# Altium project 4T2_Project_File.PrjPcb
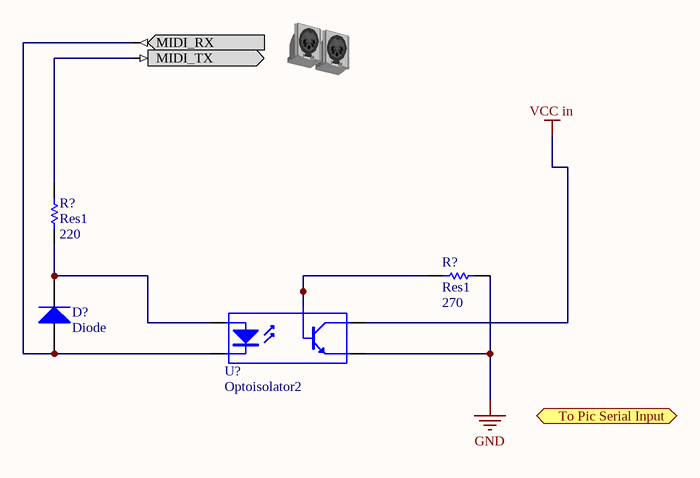
[diagram p0: Midi conector .SchDoc]
7 sheets, 57 parts. Net scope: flat (ports and power ports of the same name join across sheets).
Sheets:
  Midi conector .SchDoc
  Lcd connector.SchDoc
  pic33.SchDoc
  audioleft.SchDoc
  audiorigth.SchDoc
  Jack.SchDoc
  led encoder 1.SchDoc

## Sheet Midi conector .SchDoc
size A

### Parts
(Parts that share a designator on the sheet are numbered #1, #2 ... from top to bottom, then left to right.)
?  MIDI  (value not drawn)
D?#1  Diode  [SMC]
R?#1  Res1  value 220  [AXIAL-0.3]
R?#2  Res1  value 270  [AXIAL-0.3]
U?#1  Optoisolator2  [SOP5(6)]

### Ports
To Pic Serial Input (out)

### Nets
GND: R?#2.1 U?#1.4(E)
VCC in: U?#1.5(C)
Net?_MIDI_RX: ?.MIDI_RX D?#1.1(A) U?#1.3(K)
Net?_MIDI_TX: ?.MIDI_TX R?#1.2
NetD?#1_2: D?#1.2(K) R?#1.1 U?#1.1(A)
NetR?#2_2: R?#2.2 U?#1.6(B)

### Library data of the parts
? = MIDI: MIDI Connector; RefFabricant: PSG03463; RefConstructeur: 1791756; Constructeur: PRO SIGNAL
D?#1 = Diode: 1n914; Constructeur: FAIRCHILD SEMICONDUCTOR; RefConstructeur: 1N4454
R?#1 R?#2 = Res1: Resistor; Published: 8-Jun-2000; LatestRevisionDate: 17-Jul-2002; LatestRevisionNote: Re-released for DXP Platform.; PackageReference: AXIAL-0.3; Publisher: Altium Limited; PackageDescription: Axial Device, Thru-Hole; 2 Leads; 0.3 in Pin Spacing
U?#1 = Optoisolator2: 5 Pin Mini Flat Pack Optocoupler; RefFabricant: 6N138; RefFournisseur: 1225822; Fournisseur: TOSHIBA

## Sheet Lcd connector.SchDoc
size A
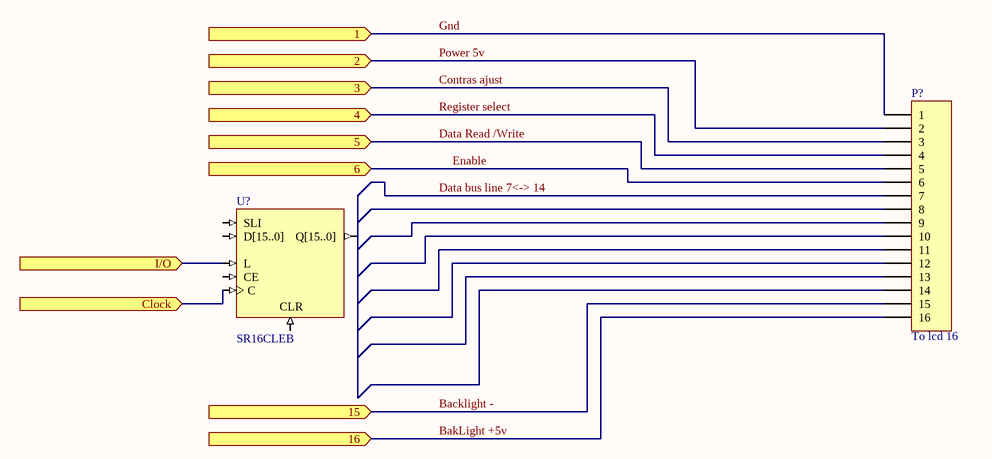
[diagram p1: Lcd connector.SchDoc]

### Parts
(Parts that share a designator on the sheet are numbered #1, #2 ... from top to bottom, then left to right.)
P?  To lcd 16  [HDR1X16]
U?#2  SR16CLEB

### Ports
1 (in), 2 (in), 3 (in), 4 (in), 5 (in), 6 (in), 15 (in), 16 (in), Clock (in), I/O (in)

### Nets
Backlight -: P?.15 ; port 15
BakLight +5v: P?.16 ; port 16
Contras ajust: P?.3 ; port 3
Data bus line 7<-> 14: P?.7
Data Read /Write: P?.5 ; port 5
Enable: P?.6 ; port 6
Gnd: P?.1 ; port 1
Power 5v: P?.2 ; port 2
Register select: P?.4 ; port 4
NetU?#2_C: U?#2.C ; port Clock
NetU?#2_L: U?#2.L ; port I/O

Not connected (* = marked no-connect by the designer): P? 8 9 10 11 12 13 14; U?#2 CE CLR D[15..0] Q[15..0] SLI

### Library data of the parts
P? = Header 16: Header, 16-Pin; LatestRevisionDate: 17-Jul-2002; LatestRevisionNote: Re-released for DXP Platform.; Publisher: Altium Limited
U?#2 = SR16CLEB: 16-Bit Loadable Serial/Parallel-In Parallel-Out Shift Registers with Clock Enable and Asynchronous Clear, Bus Version; ClockTrigger: Rising; Enable: High; Loadable: True; PortSize: 16; ArchiveName: GENERIC; VHDLIB_SIM: GENERIC_LIB; Published: 29-Jan-2004; Publisher: Altium Limited; XilinxEquivalent: SR16CLE; LastRevisionNo: 1.00.00; HelpURL: CR0118 FPGA Generic Library Guide.pdf#page=432; ComponentLink1URL: CR0141 FPGA Shift Register Resource Usage.pdf#page=28; ComponentLink1Description: Core &Resource Usage; FunctionalClass: Shift Register; Reset: Asynchronous; PortStyle: Bus Version

## Sheet pic33.SchDoc
size A
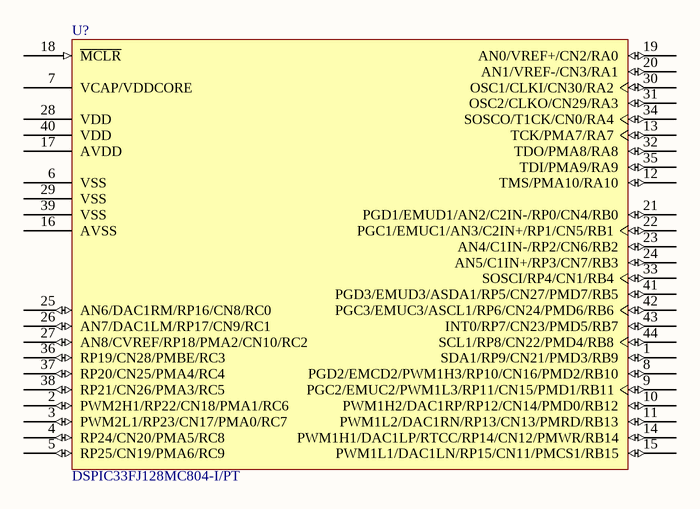
[diagram p2: pic33.SchDoc]

### Parts
(Parts that share a designator on the sheet are numbered #1, #2 ... from top to bottom, then left to right.)
U?#3  DSPIC33FJ128MC804-I/PT  [TQFP-PT44_N]

### Nets

Not connected (* = marked no-connect by the designer): U?#3 1(SDA1/RP9/CN21/PMD3/RB9) 2(PWM2H1/RP22/CN18/PMA1/RC6) 3(PWM2L1/RP23/CN17/PMA0/RC7) 4(RP24/CN20/PMA5/RC8) 5(RP25/CN19/PMA6/RC9) 6(VSS) 7(VCAP/VDDCORE) 8(PGD2/EMCD2/PWM1H3/RP10/CN16/PMD2/RB10) 9(PGC2/EMUC2/PWM1L3/RP11/CN15/PMD1/RB11) 10(PWM1H2/DAC1RP/RP12/CN14/PMD0/RB12) 11(PWM1L2/DAC1RN/RP13/CN13/PMRD/RB13) 12(TMS/PMA10/RA10) 13(TCK/PMA7/RA7) 14(PWM1H1/DAC1LP/RTCC/RP14/CN12/PMWR/RB14) 15(PWM1L1/DAC1LN/RP15/CN11/PMCS1/RB15) 16(AVSS) 17(AVDD) 18(~{MCLR}) 19(AN0/VREF+/CN2/RA0) 20(AN1/VREF-/CN3/RA1) 21(PGD1/EMUD1/AN2/C2IN-/RP0/CN4/RB0) 22(PGC1/EMUC1/AN3/C2IN+/RP1/CN5/RB1) 23(AN4/C1IN-/RP2/CN6/RB2) 24(AN5/C1IN+/RP3/CN7/RB3) 25(AN6/DAC1RM/RP16/CN8/RC0) 26(AN7/DAC1LM/RP17/CN9/RC1) 27(AN8/CVREF/RP18/PMA2/CN10/RC2) 28(VDD) 29(VSS) 30(OSC1/CLKI/CN30/RA2) 31(OSC2/CLKO/CN29/RA3) 32(TDO/PMA8/RA8) 33(SOSCI/RP4/CN1/RB4) 34(SOSCO/T1CK/CN0/RA4) 35(TDI/PMA9/RA9) 36(RP19/CN28/PMBE/RC3) 37(RP20/CN25/PMA4/RC4) 38(RP21/CN26/PMA3/RC5) 39(VSS) 40(VDD) 41(PGD3/EMUD3/ASDA1/RP5/CN27/PMD7/RB5) 42(PGC3/EMUC3/ASCL1/RP6/CN24/PMD6/RB6) 43(INT0/RP7/CN23/PMD5/RB7) 44(SCL1/RP8/CN22/PMD4/RB8)

### Library data of the parts
U?#3 = DSPIC33FJ128MC804-I/PT: High-Performance 16-bit Digital Signal Controller, 128 KB Flash, 16 KB RAM, 44-Pin TQFP, Industrial Temperature; Published: 29-Jan-2009; LatestRevisionDate: 02-Dec-2009; LatestRevisionNote: Updated to datasheet revision D, Nov-2009; DatasheetVersion: revD, Nov-2009; PackageVersion: revBB, Aug-2009; PackageReference: TQFP-PT44; Publisher: Altium Limited; PackageDescription: 44-Lead Plastic Thin Quad Flatpack (PT) - 10x10x1mm Body, 2.00mm [TQFP]; Supplier 1: Digi-Key; Supplier Part Number 1: DSPIC33FJ128MC804-I/PT-ND; Supplier 2: Farnell; Supplier Part Number 2: 1576810; Code_JEDEC: MS-026; ComponentLink1Description: Datasheet; ComponentLink1URL: http://ww1.microchip.com/downloads/en/DeviceDoc/70291D.pdf; ComponentLink2Description: Packaging Specification; ComponentLink2URL: http://www.microchip.com/stellent/groups/techpub_sg/documents/packagingspec/en012702.pdf; ComponentLink3Description: Microchip.com Home; ComponentLink3URL: http://www.microchip.com/

## Sheet audioleft.SchDoc
size A
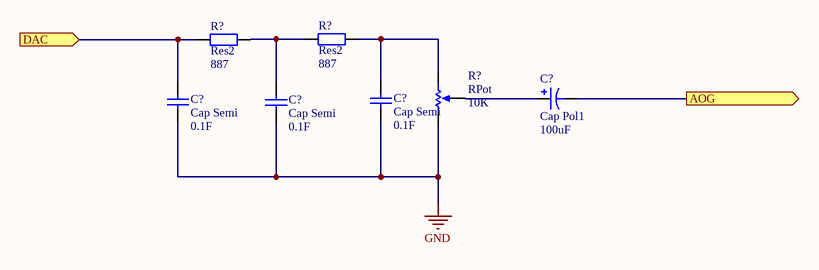
[diagram p3: audioleft.SchDoc]

### Parts
(Parts that share a designator on the sheet are numbered #1, #2 ... from top to bottom, then left to right.)
C?#1  Cap Pol1  value 100uF  [RB7.6-15]
C?#2  Cap Semi  value 0.1F  [C2512]
C?#3  Cap Semi  value 0.1F  [C2512]
C?#4  Cap Semi  value 0.1F  [C2512]
R?#3  Res2  value 887  [AXIAL-0.4]
R?#4  Res2  value 887  [AXIAL-0.4]
R?#5  RPot  value 10K  [VR5]

### Ports
AOG (out), DAC (in)

### Nets
GND: C?#2.1 C?#3.1 C?#4.1 R?#5.1(TOP)
NetC?#1_1: C?#1.1 R?#5.3(TAP)
NetC?#1_2: C?#1.2 ; port AOG
NetC?#2_2: C?#2.2 R?#3.1 ; port DAC
NetC?#3_2: C?#3.2 R?#3.2 R?#4.1
NetC?#4_2: C?#4.2 R?#4.2 R?#5.2(BOT)

### Library data of the parts
C?#1 = Cap Pol1: Polarized Capacitor (Radial); Constructeur: PANASONIC; Ref constructeur: EEUFM1E101; Vendeur: Farnell
C?#2-C?#4 = Cap Semi: Capacitor (Semiconductor SIM Model); Vendeur: Farnell; Fabricant: KEMET; Ref Fabricant: FG0H104ZF
R?#3 R?#4 = Res2: Resistor; Fabricant: VISHAY BC COMPONENTS; Ref Fabricant: MRS25000C8870FCT00; Vendeur: Farnell
R?#5 = RPot: Potentiometer; Fabricant: TE CONNECTIVITY / CITEC; Ref Fabricant: CP16SH10IP06103F; Vendeur: Farnell

## Sheet audiorigth.SchDoc
size A
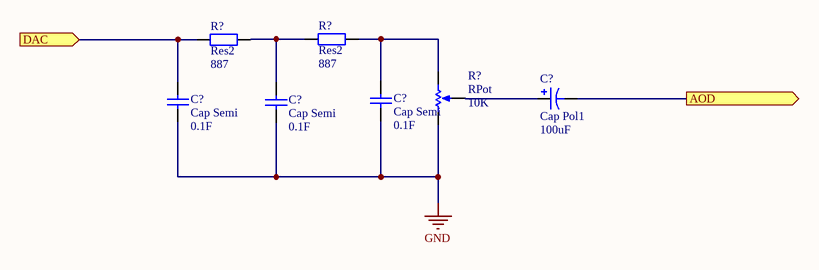
[diagram p4: audiorigth.SchDoc]

### Parts
(Parts that share a designator on the sheet are numbered #1, #2 ... from top to bottom, then left to right.)
C?#5  Cap Pol1  value 100uF  [RB7.6-15]
C?#6  Cap Semi  value 0.1F  [C2512]
C?#7  Cap Semi  value 0.1F  [C2512]
C?#8  Cap Semi  value 0.1F  [C2512]
R?#6  Res2  value 887  [AXIAL-0.4]
R?#7  Res2  value 887  [AXIAL-0.4]
R?#8  RPot  value 10K  [VR5]

### Ports
AOD (out), DAC (in)

### Nets
GND: C?#6.1 C?#7.1 C?#8.1 R?#8.1(TOP)
NetC?#2_2: C?#6.2 R?#6.1 ; port DAC
NetC?#5_1: C?#5.1 R?#8.3(TAP)
NetC?#5_2: C?#5.2 ; port AOD
NetC?#7_2: C?#7.2 R?#6.2 R?#7.1
NetC?#8_2: C?#8.2 R?#7.2 R?#8.2(BOT)

### Library data of the parts
C?#5 = Cap Pol1: as C?#1 on sheet audioleft
C?#6-C?#8 = Cap Semi: as C?#2 on sheet audioleft
R?#6 R?#7 = Res2: as R?#3 on sheet audioleft
R?#8 = RPot: as R?#5 on sheet audioleft

## Sheet Jack.SchDoc
size A
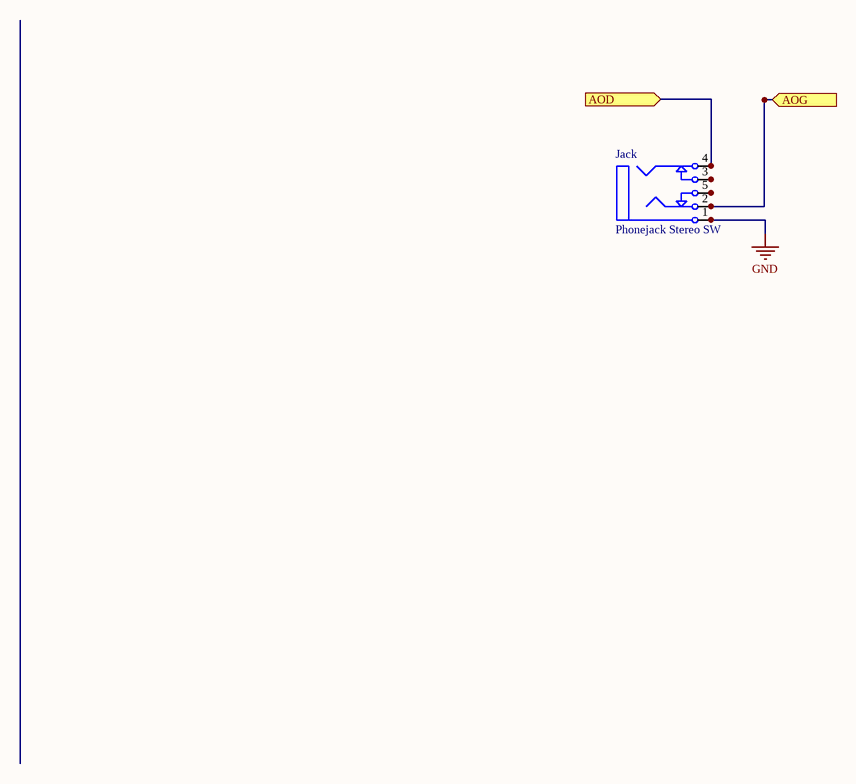
[diagram p5: Jack.SchDoc]

### Parts
Jack  Phonejack Stereo SW  [ST-3150-5N]

### Ports
AOD (in), AOG (in)

### Nets
GND: Jack.1 Jack.1A Jack.1B
NetC?#1_2: Jack.2 Jack.2A Jack.2B ; port AOG
NetC?#5_2: Jack.4 Jack.4A Jack.4B ; port AOD
NetJack_3: Jack.3 Jack.3A Jack.3B
NetJack_5: Jack.5 Jack.5A Jack.5B

### Library data of the parts
Jack = Phonejack Stereo SW: 3-Conductor Jack with 2 break contacts (normals) and 2 auxiliary make contacts; Ref constructeur: ACJM-PVB-2S; Constructeur: Amphenol; Vendeur: Farnell

## Sheet led encoder 1.SchDoc
size A
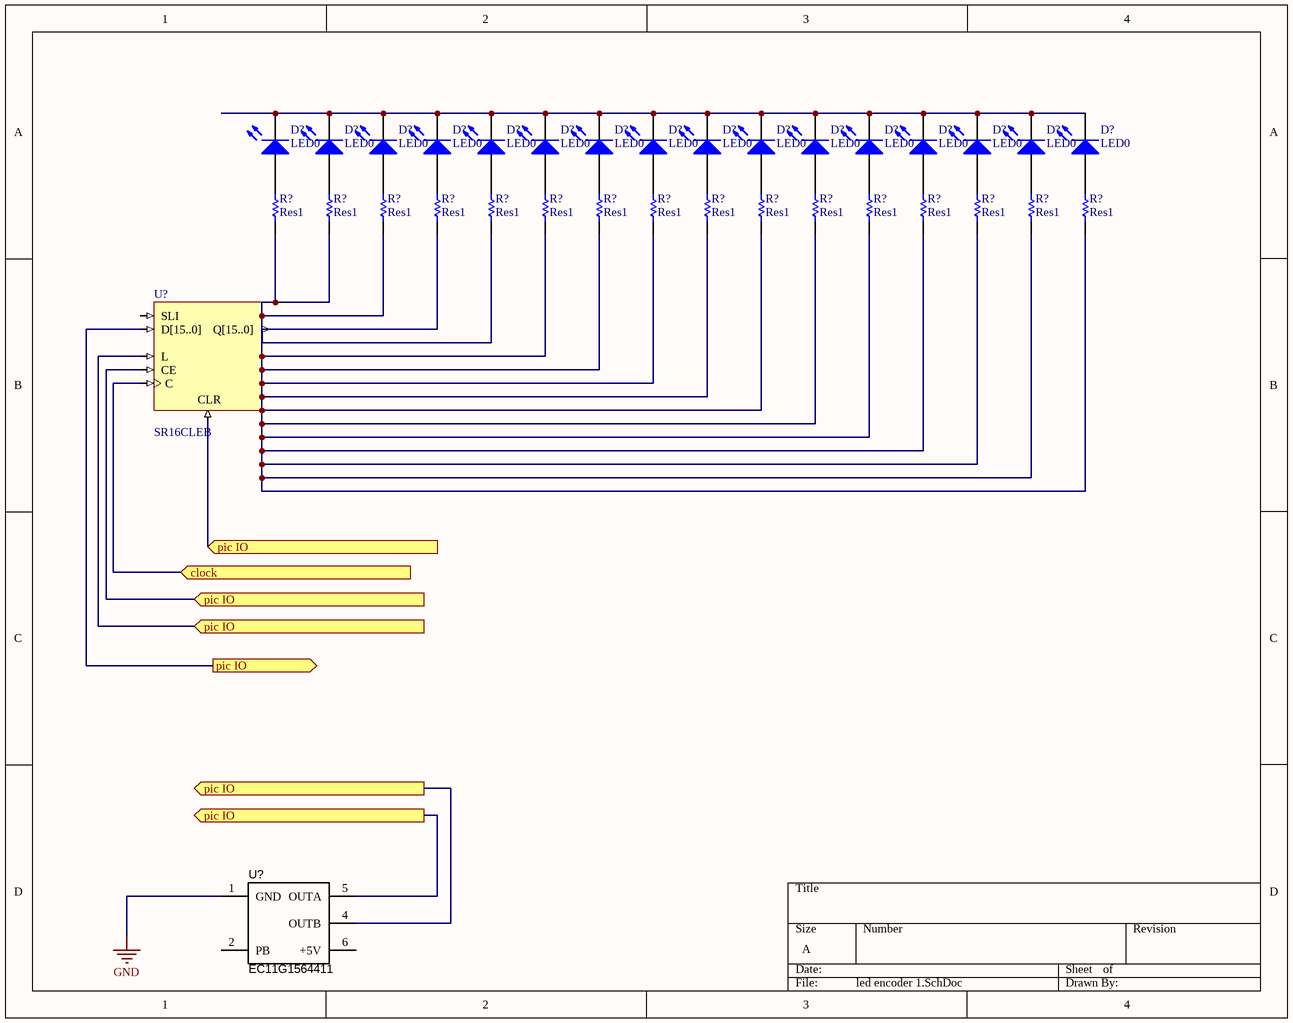
[diagram p6: led encoder 1.SchDoc]

### Parts
(Parts that share a designator on the sheet are numbered #1, #2 ... from top to bottom, then left to right.)
D?#2  LED0  [LED-0]
D?#3  LED0  [LED-0]
D?#4  LED0  [LED-0]
D?#5  LED0  [LED-0]
D?#6  LED0  [LED-0]
D?#7  LED0  [LED-0]
D?#8  LED0  [LED-0]
D?#9  LED0  [LED-0]
D?#10  LED0  [LED-0]
D?#11  LED0  [LED-0]
D?#12  LED0  [LED-0]
D?#13  LED0  [LED-0]
D?#14  LED0  [LED-0]
D?#15  LED0  [LED-0]
D?#16  LED0  [LED-0]
D?#17  LED0  [LED-0]
R?#9  Res1  [AXIAL-0.3]
R?#10  Res1  [AXIAL-0.3]
R?#11  Res1  [AXIAL-0.3]
R?#12  Res1  [AXIAL-0.3]
R?#13  Res1  [AXIAL-0.3]
R?#14  Res1  [AXIAL-0.3]
R?#15  Res1  [AXIAL-0.3]
R?#16  Res1  [AXIAL-0.3]
R?#17  Res1  [AXIAL-0.3]
R?#18  Res1  [AXIAL-0.3]
R?#19  Res1  [AXIAL-0.3]
R?#20  Res1  [AXIAL-0.3]
R?#21  Res1  [AXIAL-0.3]
R?#22  Res1  [AXIAL-0.3]
R?#23  Res1  [AXIAL-0.3]
R?#24  Res1  [AXIAL-0.3]
U?#4  SR16CLEB
U?#5  EC11G1564411  [EC11G1564411]  (mechanical)

### Ports
clock (in), pic IO (in), pic IO (out)

### Nets
GND: U?#5.1(GND)
NetD?#2_1: D?#2.1(A) R?#9.2
NetD?#2_2: D?#2.2(K) D?#3.2(K) D?#4.2(K) D?#5.2(K) D?#6.2(K) D?#7.2(K) D?#8.2(K) D?#9.2(K) D?#10.2(K) D?#11.2(K) D?#12.2(K) D?#13.2(K) D?#14.2(K) D?#15.2(K) D?#16.2(K) D?#17.2(K)
NetD?#3_1: D?#3.1(A) R?#10.2
NetD?#4_1: D?#4.1(A) R?#11.2
NetD?#5_1: D?#5.1(A) R?#12.2
NetD?#6_1: D?#6.1(A) R?#13.2
NetD?#7_1: D?#7.1(A) R?#14.2
NetD?#8_1: D?#8.1(A) R?#15.2
NetD?#9_1: D?#9.1(A) R?#16.2
NetD?#10_1: D?#10.1(A) R?#17.2
NetD?#11_1: D?#11.1(A) R?#18.2
NetD?#12_1: D?#12.1(A) R?#19.2
NetD?#13_1: D?#13.1(A) R?#20.2
NetD?#14_1: D?#14.1(A) R?#21.2
NetD?#15_1: D?#15.1(A) R?#22.2
NetD?#16_1: D?#16.1(A) R?#23.2
NetD?#17_1: D?#17.1(A) R?#24.2
NetR?#9_1: R?#9.1 R?#10.1 R?#11.1 R?#12.1 R?#13.1 R?#14.1 R?#15.1 R?#16.1 R?#17.1 R?#18.1 R?#19.1 R?#20.1 R?#21.1 R?#22.1 R?#23.1 R?#24.1 U?#4.Q[15..0]
NetU?#2_C: U?#4.C ; port clock
NetU?#4_CE: U?#4.CE U?#4.CLR U?#4.D[15..0] U?#4.L U?#5.4(OUTB) U?#5.5(OUTA) ; port pic IO

Not connected (* = marked no-connect by the designer): U?#4 SLI; U?#5 2(PB) 6(+5V)

### Library data of the parts
D?#2 = LED0: Typical INFRARED GaAs LED; Fabricant: farnell; Constructeur: MULTICOMP; RefFabricant: 1716697; RefConstructeur: OVL-3323
D?#3-D?#17 = LED0: Typical INFRARED GaAs LED; Fabricant: *; Constructeur: *; RefFabricant: *; RefConstructeur: *
R?#9-R?#24 = Res1: Resistor; Fabricant: *; Constructeur: *; RefFabricant: *; RefConstructeur: *
U?#4 = SR16CLEB: as U?#2 on sheet Lcd connector; Published: 29-Jan-2004; Publisher: Altium Limited; XilinxEquivalent: SR16CLE; LastRevisionNo: 1.00.00; HelpURL: CR0118 FPGA Generic Library Guide.pdf#page=432; ComponentLink1URL: CR0141 FPGA Shift Register Resource Usage.pdf#page=28; ComponentLink1Description: Core &Resource Usage; FunctionalClass: Shift Register; Reset: Asynchronous; PortStyle: Bus Version
U?#5 = ENCODER_OPT_0.25in shaft_with cable: Encoder optical rotary panel mount no pushbutton; RefConstructeur: EC12E2424407; RefFabricant: 1520813; Fabricant: Farnell; Constructeur: Alps

## Nets that join several sheets
GND: Midi conector  (R?#2.1 U?#1.4), audioleft (C?#2.1 C?#3.1 C?#4.1 R?#5.1), audiorigth (C?#6.1 C?#7.1 C?#8.1 R?#8.1), Jack (Jack.1 Jack.1A Jack.1B), led encoder 1 (U?#5.1)
NetC?#1_2: audioleft (C?#1.2), Jack (Jack.2 Jack.2A Jack.2B)
NetC?#2_2: audioleft (C?#2.2 R?#3.1), audiorigth (C?#6.2 R?#6.1)
NetC?#5_2: audiorigth (C?#5.2), Jack (Jack.4 Jack.4A Jack.4B)
NetU?#2_C: Lcd connector (U?#2.C), led encoder 1 (U?#4.C)